# Altium project BB-ADC.PrjPCB
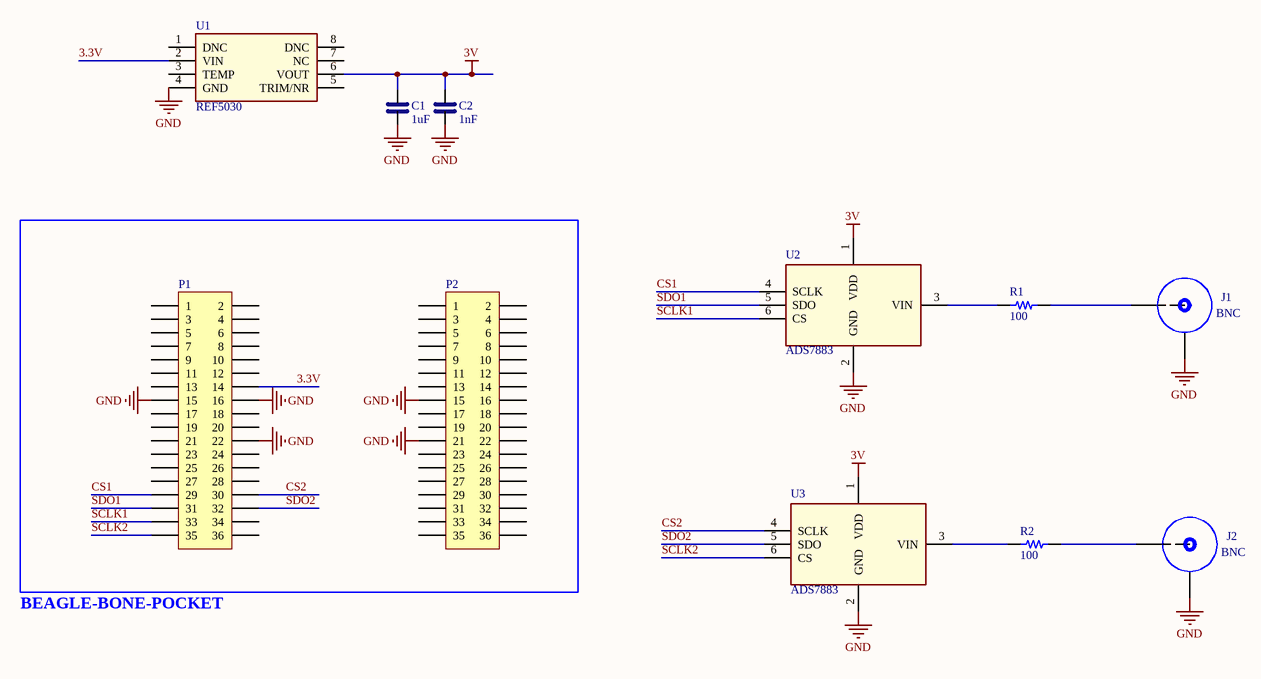
[diagram p0: BB-ADC.SchDoc]
1 sheet, 11 parts. Net scope: global (net labels, ports and power ports of the same name join across sheets).
Board file: BB-ADC.PcbDoc

## Sheet BB-ADC.SchDoc
size A4

### Parts
C1  1uF  [CAP 0805/2012]
C2  1nF  [CAP 0805/2012]
J1  BNC  [BNC Straight]
J2  BNC  [BNC Straight]
P1  Beagle-Pocket  [HDR2X18]  (value not drawn)
P2  Beagle-Pocket  [HDR2X18]  (value not drawn)
R1  100  [RES 0805/2012]
R2  100  [RES 0805/2012]
U1  REF5030  [SOIC-8 (150mil-3.9mm width)]
U2  ADS7883  [SOT-23-6]
U3  ADS7883  [SOT-23-6]

### Nets
3V: C1.2 C2.2 U1.6(VOUT) U2.1(VDD) U3.1(VDD)
GND: C1.1 C2.1 J1.2 J2.2 P1.15 P1.16 P1.22 P2.15 P2.21 U1.4(GND) U2.2(GND) U3.2(GND)
3.3V: P1.14 U1.2(VIN)
CS1: P1.29 U2.4(SCLK)
CS2: P1.30 U3.4(SCLK)
SCLK1: P1.33 U2.6(CS)
SCLK2: P1.35 U3.6(CS)
SDO1: P1.31 U2.5(SDO)
SDO2: P1.32 U3.5(SDO)
NetJ1_1: J1.1 R1.2
NetJ2_1: J2.1 R2.2
NetR1_1: R1.1 U2.3(VIN)
NetR2_1: R2.1 U3.3(VIN)

Not connected (* = marked no-connect by the designer): P1 1 2 3 4 5 6 7 8 9 10 11 12 13 17 18 19 20 21 23 24 25 26 27 28 34 36; P2 1 2 3 4 5 6 7 8 9 10 11 12 13 14 16 17 18 19 20 22 23 24 25 26 27 28 29 30 31 32 33 34 35 36; U1 1(DNC) 3(TEMP) 5(TRIM/NR) 7(NC) 8(DNC)

### Notes on the sheet
- BEAGLE-BONE-POCKET

### Library data of the parts
C1 C2 = CAP 0805/2012
J1 J2 = BNC: RF Connectors / Coaxial Connectors BNC
P1 P2 = Header 18X2: Header, 18-Pin, Dual row; LatestRevisionDate: 17-Jul-2002; LatestRevisionNote: Re-released for DXP Platform.; Publisher: Altium Limited
R1 R2 = RES 0805/2012 ( 1/8W )
U1 = REF5030: Series Voltage Reference IC ±0.1% 10mA
U2 U3 = ADS7883: 12 Bit Analog to Digital Converter 1 Input 1 SAR SOT-23-6